# EAGLE schematic FDTI-UPDI connector (EAGLE 7.6.0)
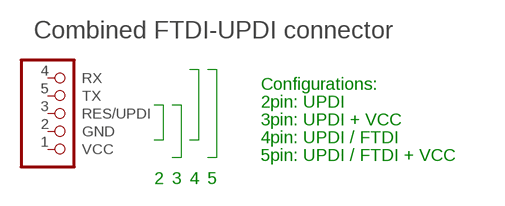
[diagram p0: schematic, sheet 1]

## Parts
J100  Combined FTDI-UPDI connector  FTDI-UPDI  [FTDI-UPDI-ZIGZAG]
Unconnected: J100.1(VCC) J100.2(GND) J100.3(RES/UPDI) J100.4(RX) J100.5(TX)

## Notes on the sheet
- Configurations:
- 2pin: UPDI
- 3pin: UPDI + VCC
- 4pin: UPDI / FTDI
- 5pin: UPDI / FTDI + VCC
- 2 | 3 | 4 | 5

## Library data of the parts
J100 = Albert:FTDI-UPDI